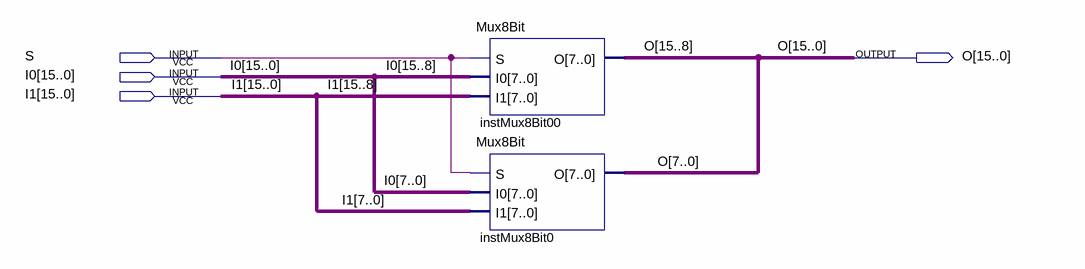
[diagram p0: schematic sheet]
// Quartus schematic Mux16Bit.bdf as structural Verilog: 2 symbols, 4 pins
module Mux16Bit (
  input  S,
  input  [15:0] I0,
  input  [15:0] I1,
  output [15:0] O
);

  Mux8Bit instMux8Bit00 (.S(S), .I0(I0[15:8]), .I1(I1[15:8]), .O(O[15:8]));
  Mux8Bit instMux8Bit0 (.S(S), .I0(I0[7:0]), .I1(I1[7:0]), .O(O[7:0]));
endmodule
